# Altium schematic sheet Power.SchDoc: z80 Single Board Computer: Power Supply Circuits
size A4; DrawnBy: Naoki Pross; DocumentNumber: 3; SheetNumber: 3; SheetTotal: 4
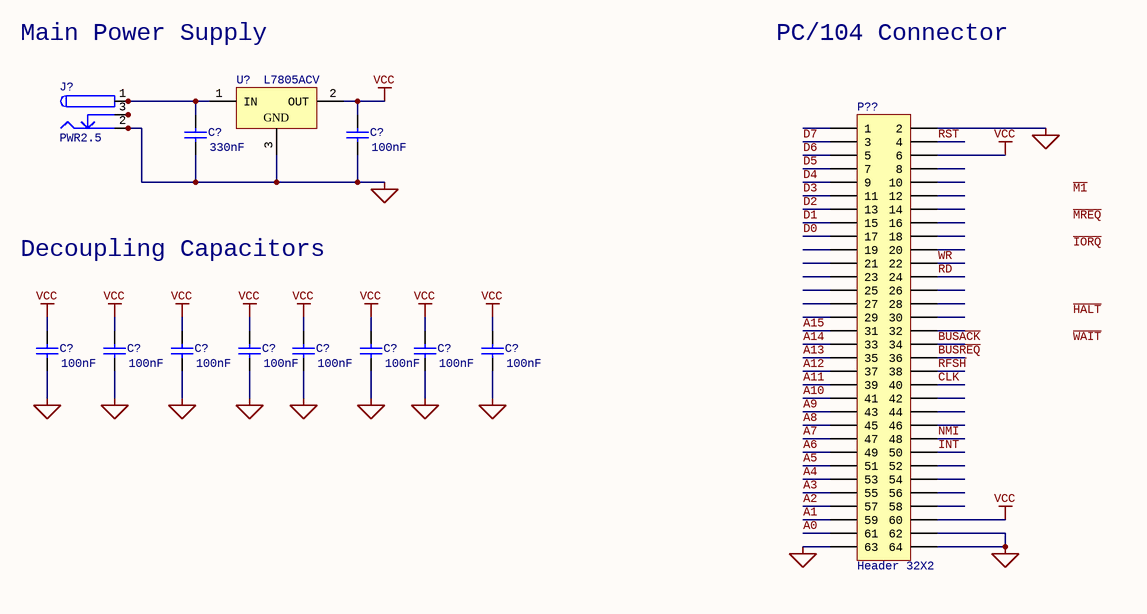
[diagram p0: Power.SchDoc]

## Parts
(Parts that share a designator on the sheet are numbered #1, #2 ... from top to bottom, then left to right.)
C?#1  value 330nF  [RAD-0.3]  (hidden comment: Cap)
C?#2  value 100nF  [RAD-0.3]  (hidden comment: Cap)
C?#3  value 100nF  [RAD-0.3]  (hidden comment: Cap)
C?#4  value 100nF  [RAD-0.3]  (hidden comment: Cap)
C?#5  value 100nF  [RAD-0.3]  (hidden comment: Cap)
C?#6  value 100nF  [RAD-0.3]  (hidden comment: Cap)
C?#7  value 100nF  [RAD-0.3]  (hidden comment: Cap)
C?#8  value 100nF  [RAD-0.3]  (hidden comment: Cap)
C?#9  value 100nF  [RAD-0.3]  (hidden comment: Cap)
C?#10  value 100nF  [RAD-0.3]  (hidden comment: Cap)
J?  PWR2.5  [KLD-0202]
P??  Header 32X2  [HDR2X30]
U?  L7805ACV  [TO220ABN]

## Nets
GND: C?#1.1 C?#2.1 C?#3.1 C?#4.1 C?#5.1 C?#6.1 C?#7.1 C?#8.1 C?#9.1 C?#10.1 J?.2 J?.2A J?.2B P??.2 P??.62 P??.63 P??.64 U?.3(GND)
VCC: C?#2.2 C?#3.2 C?#4.2 C?#5.2 C?#6.2 C?#7.2 C?#8.2 C?#9.2 C?#10.2 P??.6 P??.60 U?.2(OUT)
A0: P??.61
A1: P??.59
A2: P??.57
A3: P??.55
A4: P??.53
A5: P??.51
A6: P??.49
A7: P??.47
A8: P??.45
A9: P??.43
A10: P??.41
A11: P??.39
A12: P??.37
A13: P??.35
A14: P??.33
A15: P??.31
~{BUSACK}: P??.34
~{BUSREQ}: P??.36
CLK: P??.40
D0: P??.17
D1: P??.15
D2: P??.13
D3: P??.11
D4: P??.9
D5: P??.7
D6: P??.5
D7: P??.3
~{INT}: P??.50
NMI: P??.48
~{RD}: P??.24
~{RFSH}: P??.38
~{RST}: P??.4
~{WR}: P??.22
NetC?#1_2: C?#1.2 J?.1 J?.1A J?.1B U?.1(IN)
NetJ?_3: J?.3 J?.3A J?.3B

Not connected (* = marked no-connect by the designer): P?? 1 8 10 12 14 16 18 19 20 21 23 25 26 27 28 29 30 32 42 44 46 52 54 56 58

## Notes on the sheet
- Main Power Supply
- PC/104 Connector
- Decoupling Capacitors
- Labels drawn without touching a wire or pin: ~{HALT}, ~{IORQ}, ~{M1}, ~{MREQ}, ~{WAIT}

## Library data of the parts
C?#1-C?#10 = Cap: Capacitor; Published: 8-Jun-2000; LatestRevisionDate: 17-Jul-2002; LatestRevisionNote: Re-released for DXP Platform.; PackageReference: RAD-0.3; Publisher: Altium Limited; PackageDescription: Radial Cap, Thru-Hole; 2 Leads; 0.3 in Pin Spacing
J? = PWR2.5: Low Voltage Power Supply Connector; Published: 17-Dec-2003; DatasheetDocument: 09-May-2002; Publisher: Altium Limited; ComponentLink1Description: Manufacturer Link; ComponentLink1URL: http://domino.kycon.com/internet/Products.html
P?? = Header 32X2: Header, 32-Pin, Dual row; LatestRevisionDate: 17-Jul-2002; LatestRevisionNote: Re-released for DXP Platform.; Publisher: Altium Limited
U? = L7805ACV: Precision 1A Regulator; Note: Tab is connected to pin 3 (GND).; Published: 24-Aug-2001; LatestRevisionDate: 17-Jul-2002; LatestRevisionNote: Re-released for DXP Platform.; DatasheetVersion: Nov-1999; PackageVersion: Jun-1998; PackageReference: TO220ABN; Publisher: Altium Limited; PackageDescription: TO, Thru-Hole, Vertical, Heatsink Mounted; 3 In-Line Leads; Pitch 2.54 mm; Pin sequence 1, 3, 2; ComponentLink1Description: Manufacturer Link; ComponentLink1URL: http://www.st.com/; ComponentLink2Description: Datasheet; ComponentLink2URL: http://www.st.com/stonline/products/literature/ds/2144/l7805ab.pdf